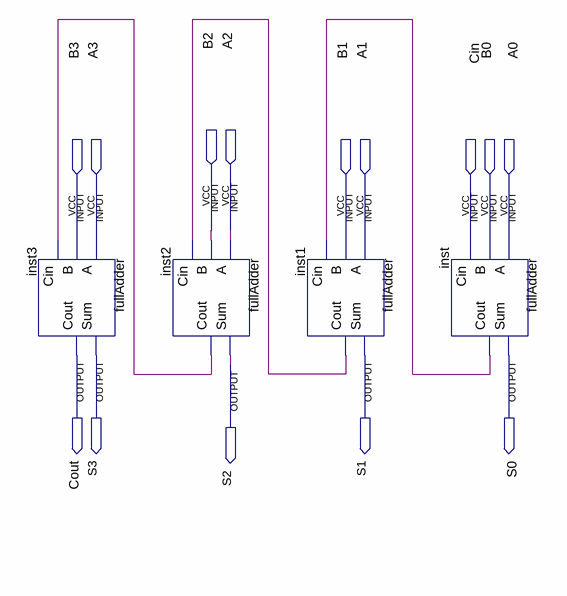
[diagram p0: schematic sheet]
// Quartus schematic RippleCarryAdder.bdf as structural Verilog: 4 symbols, 14 pins
module RippleCarryAdder (
  input  B2,
  input  A2,
  input  B3,
  input  A3,
  input  B1,
  input  A1,
  input  Cin,
  input  B0,
  input  A0,
  output Cout,
  output S3,
  output S1,
  output S0,
  output S2
);

  wire inst1_cout, inst2_cout, inst_cout;

  fullAdder inst3 (.A(A3), .B(B3), .Cin(inst2_cout), .Sum(S3), .Cout(Cout));
  fullAdder inst2 (.A(A2), .B(B2), .Cin(inst1_cout), .Sum(S2), .Cout(inst2_cout));
  fullAdder inst1 (.A(A1), .B(B1), .Cin(inst_cout), .Sum(S1), .Cout(inst1_cout));
  fullAdder inst (.A(A0), .B(B0), .Cin(Cin), .Sum(S0), .Cout(inst_cout));
endmodule
